# EAGLE schematic ArduinoMegaShield3 (EAGLE 8.4.1)
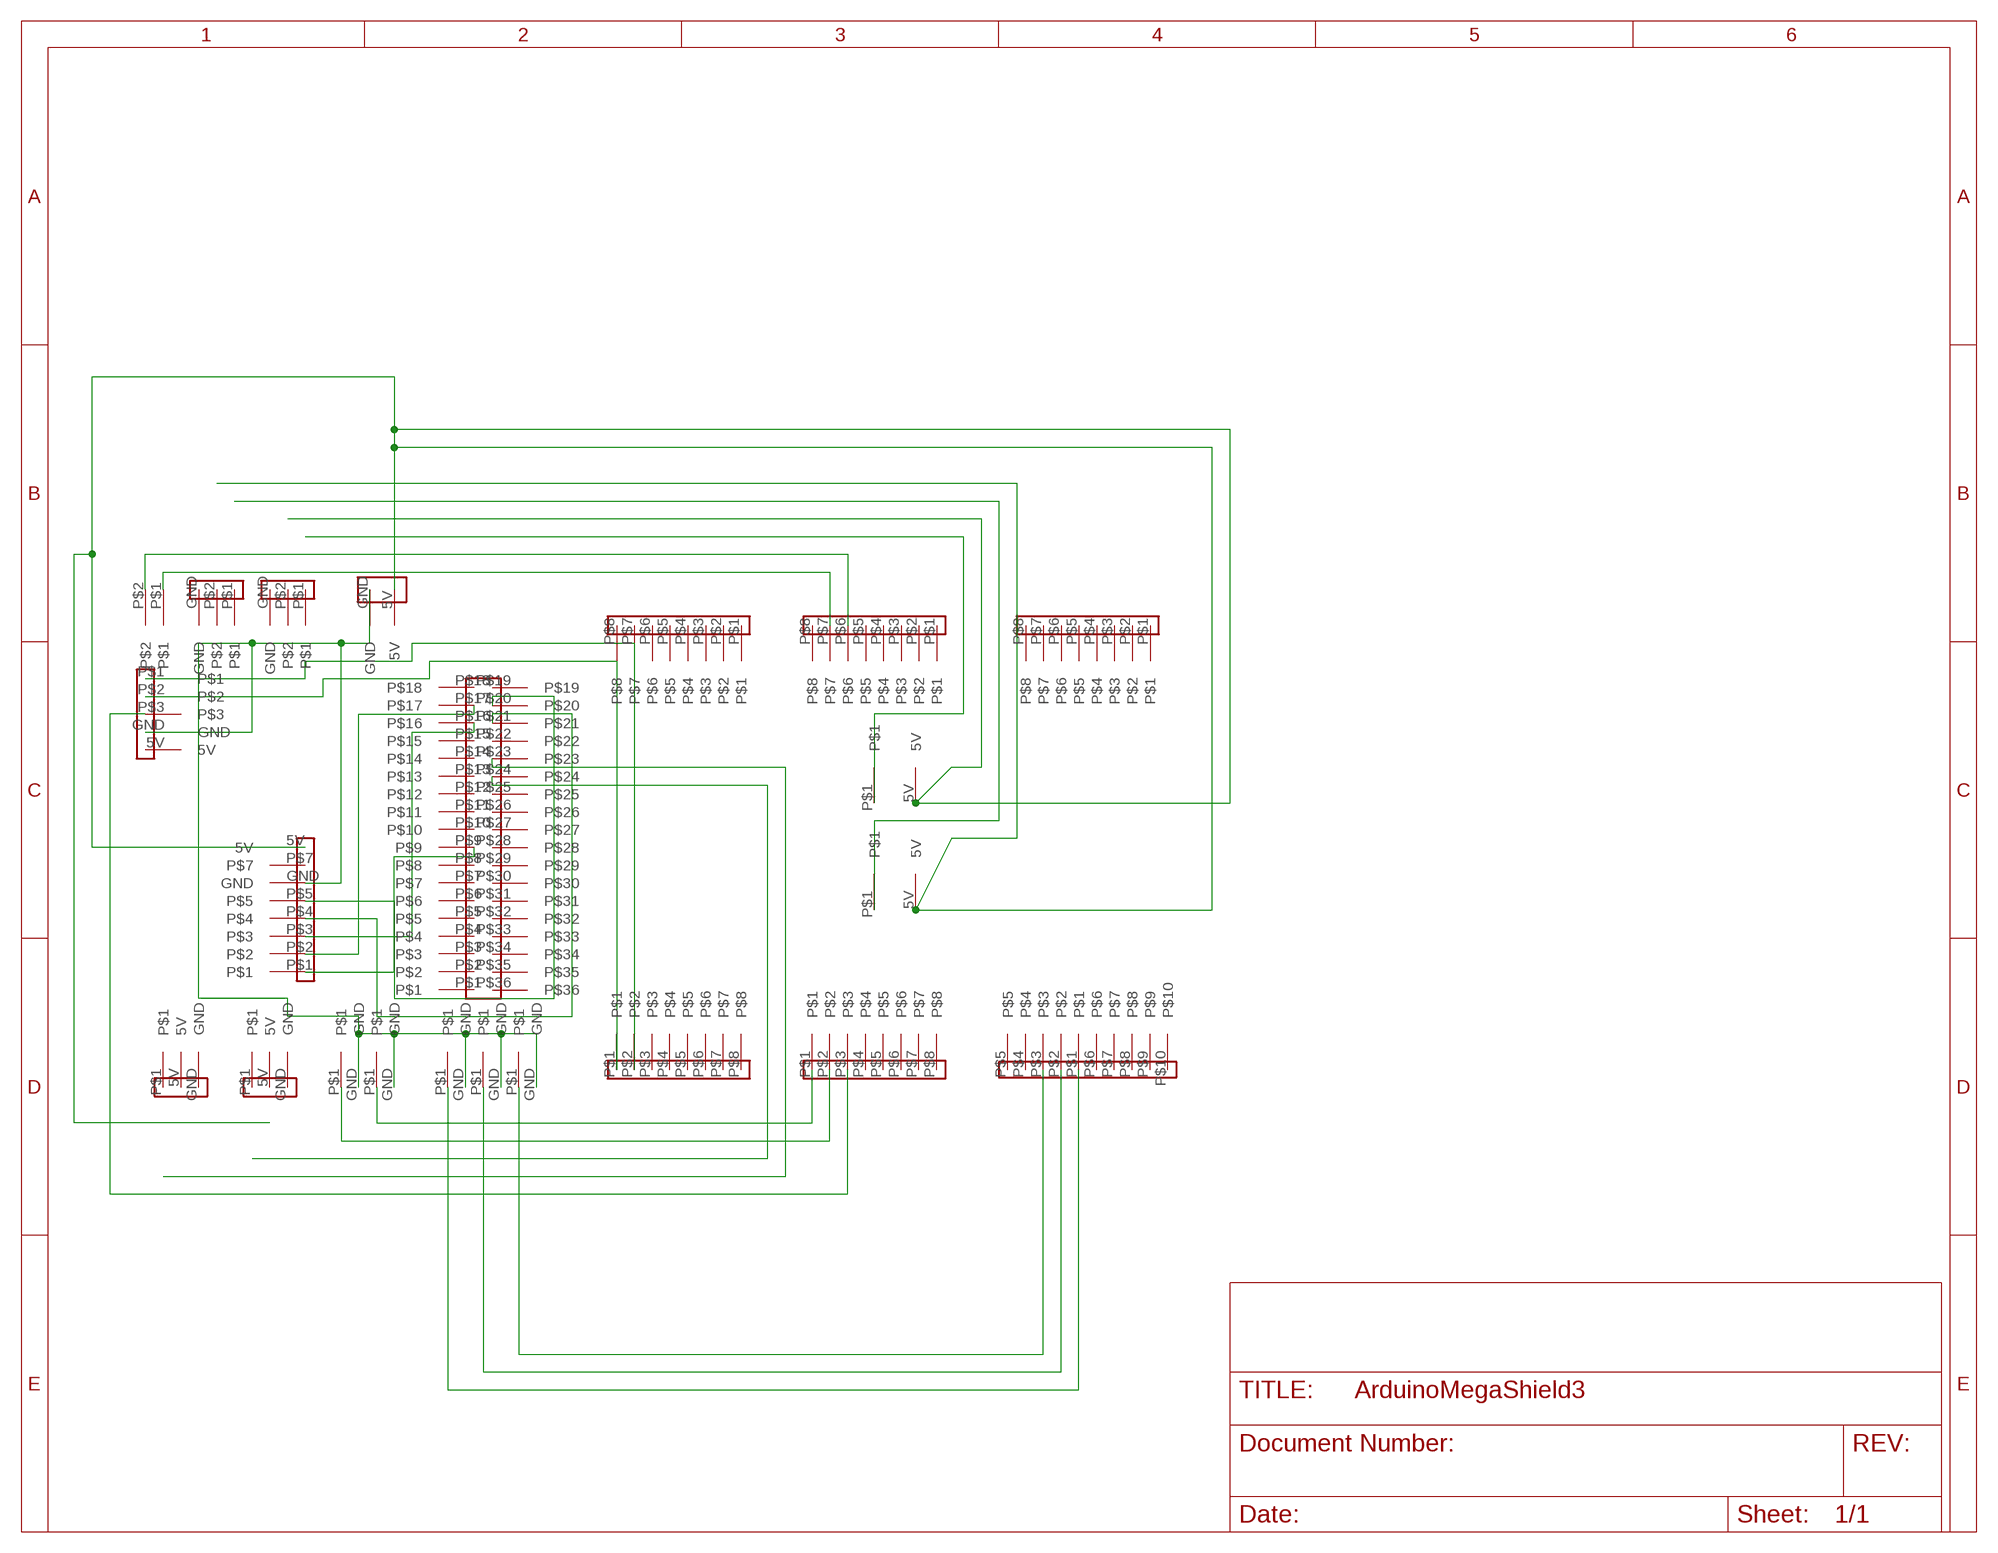
[diagram p0: schematic, sheet 1]

## Parts
U$1  8PINHEADER2.54MM  [8PINHEADER2.54MM]
U$2  8PINHEADER2.54MM  [8PINHEADER2.54MM]
U$3  8PINHEADER2.54MM  [8PINHEADER2.54MM]
U$4  8PINHEADER2.54MM  [8PINHEADER2.54MM]
U$5  8PINHEADER2.54MM  [8PINHEADER2.54MM]
U$6  10PINHEADER2.54MM  [10PINHEADER2.54MM]
U$7  18X2HEADER2.54MM  [18X2HEADER2.54MM]
U$8  5PINHEADER2.54MM  [5PINHEADER2.54MM]
U$9  SERVOS  [SERVOS]
U$10  SDCARDMODULE  [SDCARDMODULE]
U$11  SERVOS  [SERVOS]
U$12  HALLEFFECTSENSORS  [HALLEFFECTSENSORS]
U$13  HALLEFFECTSENSORS  [HALLEFFECTSENSORS]
U$14  2PIN2.54MM  [2PIN2.54MM]
U$15  2PIN2.54MM  [2PIN2.54MM]
U$17  2PIN2.54MM  [2PIN2.54MM]
U$18  2PIN2.54MM  [2PIN2.54MM]
U$19  2PIN2.54MM  [2PIN2.54MM]
U$20  2PIN11MM  [2PIN11MM]
U$21  2PIN11MM  [2PIN11MM]
U$22  BUTTONS  [BUTTONS]
U$23  2PINTERMINAL3.5MM  [2PINTERMINAL3.5MM]

## Nets
GND: U$8.GND U$10.GND U$14.GND U$15.GND U$17.GND U$18.GND U$19.GND U$23.GND
N$1: U$20.P$1
N$4: U$4.P$7 U$22.P$1
N$5: U$4.P$6 U$22.P$2
N$6: U$2.P$2 U$8.P$1
N$7: U$2.P$1 U$8.P$2
N$8: U$1.P$3 U$8.P$3
N$9: U$21.P$1
N$12: U$7.P$20 U$10.P$5
N$13: U$7.P$21 U$10.P$4
N$14: U$7.P$16 U$10.P$3
N$15: U$7.P$17 U$10.P$2
N$16: U$7.P$9 U$10.P$1
N$17: U$7.P$23
N$18: U$7.P$24
N$19: U$1.P$2 U$14.P$1
N$20: U$1.P$1 U$15.P$1
N$22: U$6.P$1 U$17.P$1
N$23: U$6.P$2 U$18.P$1
N$24: U$6.P$3 U$19.P$1
TOP: U$10.5V U$20.5V U$21.5V U$23.5V
Unconnected: U$1.P$4 U$1.P$5 U$1.P$6 U$1.P$7 U$1.P$8 U$2.P$3 U$2.P$4 U$2.P$5 U$2.P$6 U$2.P$7 U$2.P$8 U$3.P$1 U$3.P$2 U$3.P$3 U$3.P$4 U$3.P$5 U$3.P$6 U$3.P$7 U$3.P$8 U$4.P$1 U$4.P$2 U$4.P$3 U$4.P$4 U$4.P$5 U$4.P$8 U$5.P$1 U$5.P$2 U$5.P$3 U$5.P$4 U$5.P$5 U$5.P$6 U$5.P$7 U$5.P$8 U$6.P$4 U$6.P$5 U$6.P$6 U$6.P$7 U$6.P$8 U$6.P$9 U$6.P$10 U$7.P$1 U$7.P$2 U$7.P$3 U$7.P$4 U$7.P$5 U$7.P$6 U$7.P$7 U$7.P$8 U$7.P$10 U$7.P$11 U$7.P$12 U$7.P$13 U$7.P$14 U$7.P$15 U$7.P$18 U$7.P$19 U$7.P$22 U$7.P$25 U$7.P$26 U$7.P$27 U$7.P$28 U$7.P$29 U$7.P$30 U$7.P$31 U$7.P$32 U$7.P$33 U$7.P$34 U$7.P$35 U$7.P$36 U$8.5V U$9.5V U$9.GND U$9.P$1 U$10.P$7 U$11.5V U$11.GND U$11.P$1 U$12.GND U$12.P$1 U$12.P$2 U$13.GND U$13.P$1 U$13.P$2

## Library data of the parts
U$1-U$5 = ArduinoMegaShield2:8PINHEADER2.54MM
U$6 = ArduinoMegaShield2:10PINHEADER2.54MM
U$7 = ArduinoMegaShield2:18X2HEADER2.54MM
U$8 = ArduinoMegaShield2:5PINHEADER2.54MM
U$9 U$11 = ArduinoMegaShield2:SERVOS
U$10 = ArduinoMegaShield2:SDCARDMODULE
U$12 U$13 = ArduinoMegaShield2:HALLEFFECTSENSORS
U$14 U$15 U$17-U$19 = ArduinoMegaShield2:2PIN2.54MM
U$20 U$21 = ArduinoMegaShield2:2PIN11MM
U$22 = ArduinoMegaShield2:BUTTONS
U$23 = ArduinoMegaShield2:2PINTERMINAL3.5MM